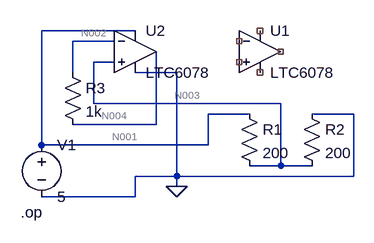
[diagram p0: schematic amplifier.asc]
amplifier.asc, the LTspice schematic file:
Version 4
SHEET 1 880 680
WIRE 16 48 -128 48
WIRE -16 64 -80 64
WIRE -16 96 -48 96
WIRE -80 112 -80 64
WIRE 80 112 16 112
WIRE -48 160 -48 96
WIRE 240 160 -48 160
WIRE 192 176 128 176
WIRE 352 176 288 176
WIRE 48 192 48 80
WIRE 48 192 -80 192
WIRE -128 224 -128 48
WIRE 128 224 128 176
WIRE 128 224 -128 224
WIRE 240 256 240 160
WIRE 240 256 192 256
WIRE 288 256 240 256
WIRE 80 272 80 112
WIRE 80 272 16 272
WIRE 352 272 352 176
WIRE 352 272 80 272
WIRE 80 288 80 272
WIRE 16 304 16 272
WIRE 16 304 -128 304
FLAG 80 288 0
SYMBOL Opamps\\LTC6078 208 80 R0
SYMATTR InstName U1
SYMBOL Opamps\\LTC6078 16 80 R0
SYMATTR InstName U2
SYMBOL res 176 160 R0
SYMATTR InstName R1
SYMATTR Value 200
SYMBOL res 272 160 R0
SYMATTR InstName R2
SYMATTR Value 200
SYMBOL res -96 96 R0
SYMATTR InstName R3
SYMATTR Value 1k
SYMBOL voltage -128 208 R0
WINDOW 123 0 0 Left 2
WINDOW 39 0 0 Left 2
SYMATTR InstName V1
SYMATTR Value 5
TEXT -160 328 Left 2 !.op

The netlist it stands for:
* amplifier.asc
XU1 NC_01 NC_02 NC_03 NC_04 NC_05 LTC6078  ; pins IN+ IN- VCC VEE OUT
XU2 N003 N002 N001 0 N004 LTC6078  ; pins IN+ IN- VCC VEE OUT
R1 N001 N003 200
R2 0 N003 200
R3 N002 N004 1k
V1 N001 0 5
.op
.lib LTC5.lib
.backanno
.end

* Results of the author's LTspice run, read from the files saved beside the schematic
* Operating Point:
*   V(n004) = 2.5 V
*   V(n001) = 5 V
*   V(n003) = 2.5 V
*   V(n002) = 2.5 V
*   I(R3) = 2.7 pA
*   I(R2) = -12.5 mA
*   I(R1) = 12.5 mA
*   I(V1) = -12.55 mA
*   Ix(u1:1) = 0 A
*   Ix(u1:2) = 0 A
*   Ix(u1:3) = 0 A
*   Ix(u1:4) = 0 A
*   Ix(u1:5) = 0 A
*   Ix(u2:1) = -2.7 pA
*   Ix(u2:2) = -2.7 pA
*   Ix(u2:3) = 54.97 µA
*   Ix(u2:4) = -54.97 µA
*   Ix(u2:5) = 2.7 pA
* From the log:
*   Semiconductor Device Operating Points:
*                           --- Diodes ---
*   Name:    d:u2:2      d:u2:3      d:u2:1      d:u2:11     d:u2:10
*   Model:    u2:dp     u2:dbias    u2:dbias     u2:desd     u2:desd
*   Id:      3.65e-05    2.70e-12    2.70e-12   -2.75e-12   -2.75e-12
*   Vd:      5.00e+00    2.50e+00    2.50e+00   -2.50e+00   -2.50e+00
*   Req:     1.00e-04    1.00e-09    1.00e-09    1.00e-13    1.00e-13
*   CAP:     0.00e+00    0.00e+00    0.00e+00    0.00e+00    0.00e+00
*   Name:    d:u2:7      d:u2:6      d:u2:9      d:u2:8      d:u2:5
*   Model:   u2:desd     u2:desd     u2:dlim    u2:dlimp    u2:dlimn
*   Id:     -2.75e-12   -2.75e-12    3.38e-10    3.42e-09    3.38e-09
*   Vd:     -2.50e+00   -2.50e+00    1.69e-01    3.42e-01    3.38e-01
*   Req:     1.00e-13    1.00e-13    2.00e-09    1.00e-08    1.00e-08
*   CAP:     0.00e+00    0.00e+00    0.00e+00    0.00e+00    0.00e+00
*   Name:    d:u1:2      d:u1:3      d:u1:1      d:u1:11     d:u1:10
*   Model:    u1:dp     u1:dbias    u1:dbias     u1:desd     u1:desd
*   Id:     -7.70e-15   -4.35e-18   -4.35e-18    6.07e-18    2.39e-18
*   Vd:     -7.69e-06   -2.17e-06   -2.17e-06    5.52e-06    2.17e-06
*   Req:     1.00e-09    1.00e-12    1.00e-12    1.00e-13    1.00e-13
*   CAP:     0.00e+00    0.00e+00    0.00e+00    0.00e+00    0.00e+00
*   Name:    d:u1:7      d:u1:6      d:u1:9      d:u1:8      d:u1:5
*   Model:   u1:desd     u1:desd     u1:dlim    u1:dlimp    u1:dlimn
*   Id:      6.07e-18    2.39e-18    3.38e-10    3.42e-09    3.38e-09
*   Vd:      5.52e-06    2.17e-06    1.69e-01    3.42e-01    3.38e-01
*   Req:     1.00e-13    1.00e-13    2.00e-09    1.00e-08    1.00e-08
*   CAP:     0.00e+00    0.00e+00    0.00e+00    0.00e+00    0.00e+00
*                           --- VDMOSFET Transistors ---
*   Name:        m:u2:2      m:u2:1      m:u1:2      m:u1:1
*   Model:        u2:pi       u2:ni       u1:pi       u1:ni
*   Id:         -1.85e-05    1.85e-05    3.42e-09   -3.42e-09
*   Vgs:        -3.42e-01    3.38e-01   -3.42e-01    3.38e-01
*   Vds:        -2.50e+00    2.50e+00    4.05e-06   -3.64e-06
*   Vth:        -3.00e-01    3.00e-01   -3.00e-01    3.00e-01
*   Gm:          8.70e-04    9.73e-04    8.09e-08    9.11e-08
*   Gds:         1.80e-07    1.80e-07    8.46e-04    9.40e-04
*   Cgs:         0.00e+00    0.00e+00    0.00e+00    0.00e+00
*   Cgd:         0.00e+00    0.00e+00    0.00e+00    0.00e+00
*   Cbody:       0.00e+00    0.00e+00    0.00e+00    0.00e+00